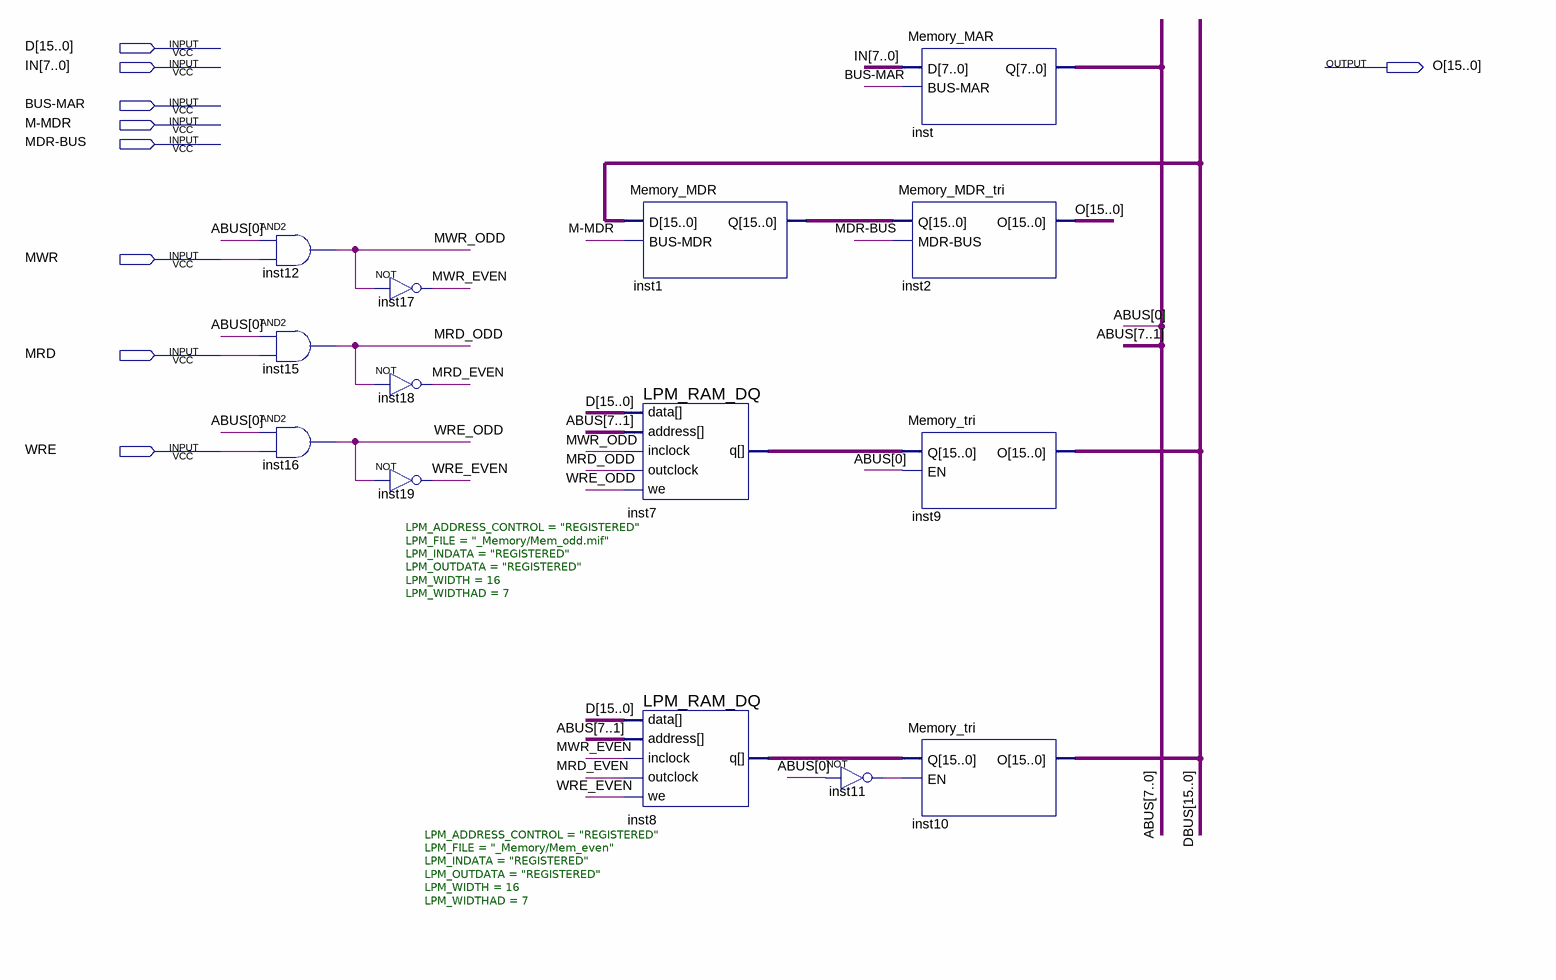
[diagram p0: schematic sheet]
// Quartus schematic Memory.bdf as structural Verilog: 14 symbols, 9 pins
module Memory (
  input  [15:0] D,
  input  [7:0] IN,
  input  \BUS-MAR ,
  input  \M-MDR ,
  input  \MDR-BUS ,
  input  MWR,
  input  MRD,
  input  WRE,
  output [15:0] O
);

  wire inst11_out, MRD_EVEN, MRD_ODD, MWR_EVEN, MWR_ODD, WRE_EVEN, WRE_ODD;
  wire [7:0] ABUS;
  wire [15:0] DBUS, inst1_q, inst7_q, inst8_q;

  and inst12 (MWR_ODD, ABUS[0], MWR);
  and inst15 (MRD_ODD, ABUS[0], MRD);
  and inst16 (WRE_ODD, ABUS[0], WRE);
  not inst17 (MWR_EVEN, MWR_ODD);
  not inst18 (MRD_EVEN, MRD_ODD);
  not inst19 (WRE_EVEN, WRE_ODD);
  Memory_MDR inst1 (.D(DBUS), .\BUS-MDR (\M-MDR ), .Q(inst1_q));
  LPM_RAM_DQ #(.LPM_ADDRESS_CONTROL("REGISTERED"), .LPM_FILE("_Memory/Mem_odd.mif"), .LPM_INDATA("REGISTERED"), .LPM_OUTDATA("REGISTERED"), .LPM_WIDTH(16), .LPM_WIDTHAD(7)) inst7 (
    .inclock(MWR_ODD), .data(D), .address(ABUS[7:1]), .we(WRE_ODD), .outclock(MRD_ODD), .q(inst7_q));
  LPM_RAM_DQ #(.LPM_ADDRESS_CONTROL("REGISTERED"), .LPM_FILE("_Memory/Mem_even"), .LPM_INDATA("REGISTERED"), .LPM_OUTDATA("REGISTERED"), .LPM_WIDTH(16), .LPM_WIDTHAD(7)) inst8 (
    .inclock(MWR_EVEN), .data(D), .address(ABUS[7:1]), .we(WRE_EVEN), .outclock(MRD_EVEN), .q(inst8_q));
  not inst11 (inst11_out, ABUS[0]);
  Memory_MAR inst (.D(IN), .\BUS-MAR (\BUS-MAR ), .Q(ABUS));
  Memory_MDR_tri inst2 (.Q(inst1_q), .\MDR-BUS (\MDR-BUS ), .O(O));
  Memory_tri inst9 (.Q(inst7_q), .EN(ABUS[0]), .O(DBUS));
  Memory_tri inst10 (.Q(inst8_q), .EN(inst11_out), .O(DBUS));
endmodule
